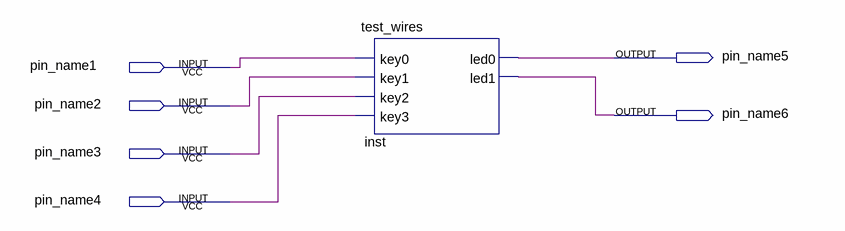
[diagram p0: schematic sheet]
// Quartus schematic main.bdf as structural Verilog: 1 symbols, 6 pins
module main (
  input  pin_name1,
  input  pin_name2,
  input  pin_name3,
  input  pin_name4,
  output pin_name5,
  output pin_name6
);

  test_wires inst (
    .key0(pin_name1), .key1(pin_name2), .key2(pin_name3), .key3(pin_name4), .led0(pin_name5), .led1(pin_name6));
endmodule
